# EAGLE schematic Solar LEDs (EAGLE 9.6.2)
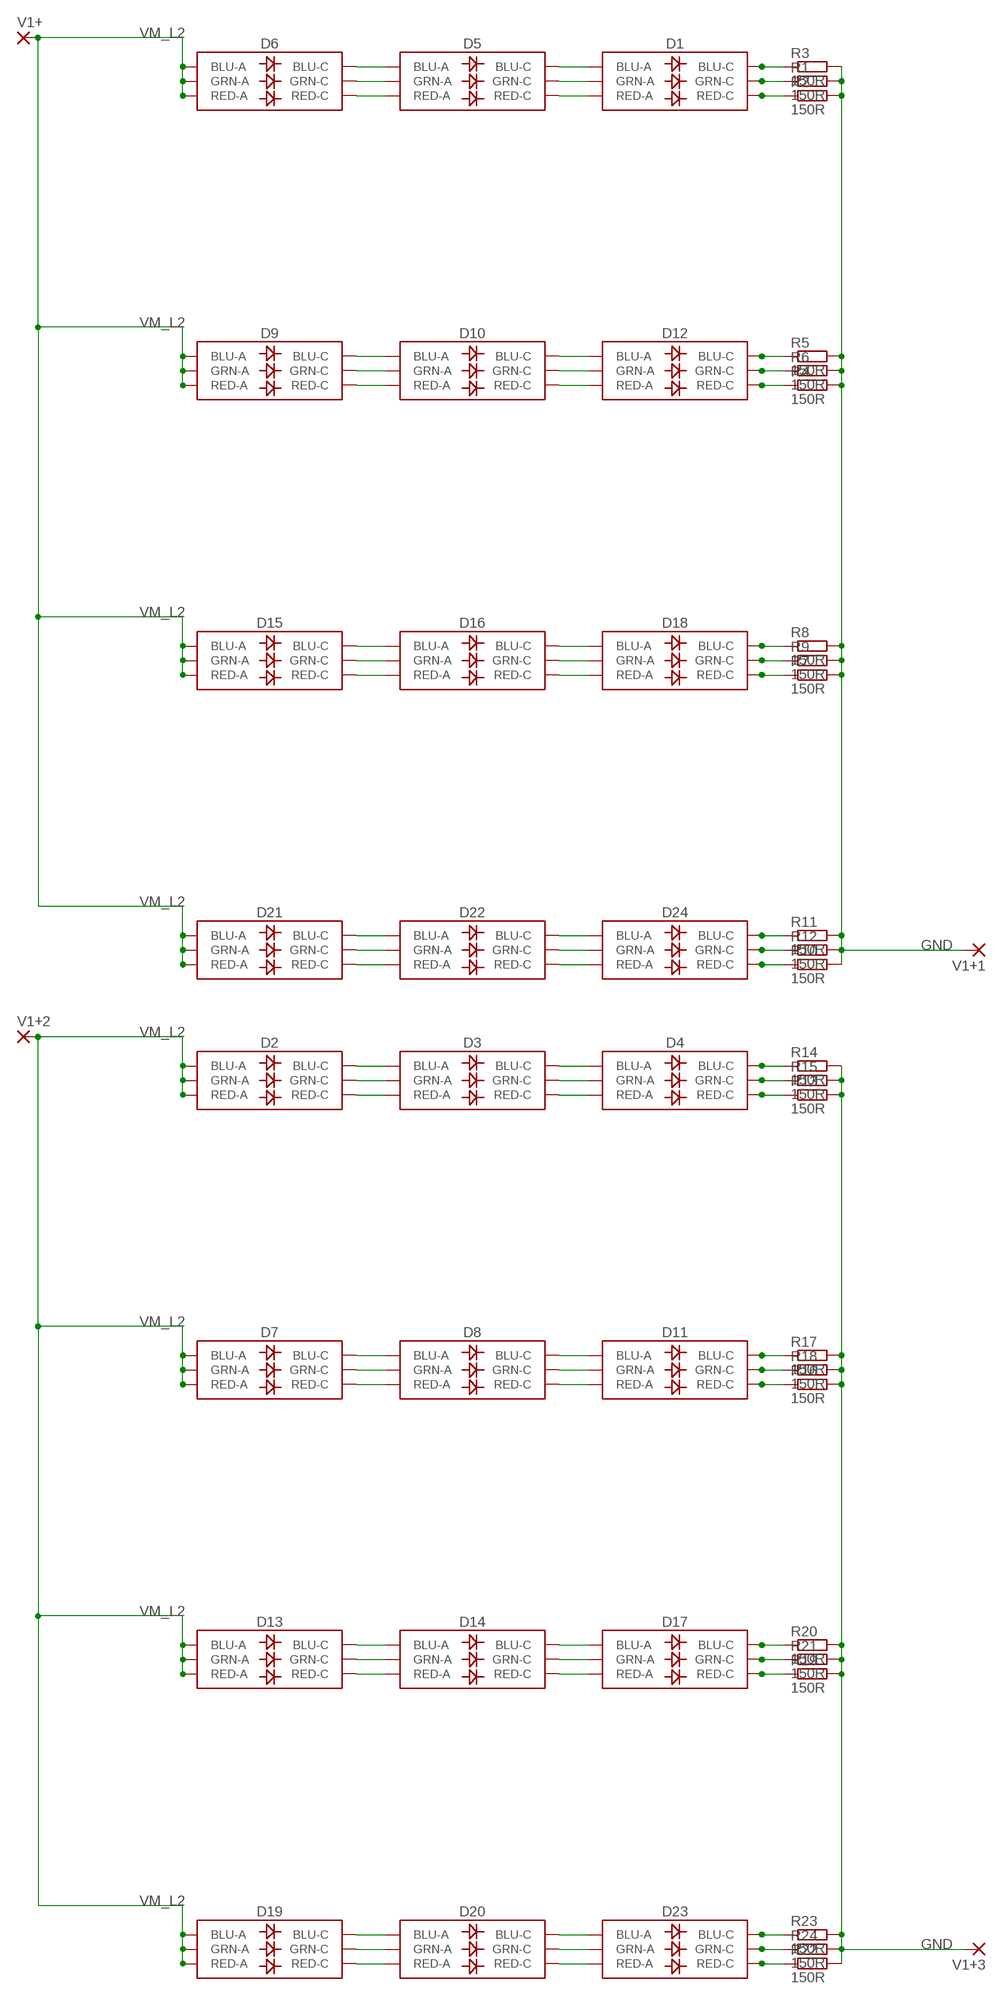
[diagram p0: schematic, sheet 1]

## Parts
D1  LED-RGBNO_IC  [LED-TRICOLOR-5050]
D2  LED-RGBNO_IC  [LED-TRICOLOR-5050]
D3  LED-RGBNO_IC  [LED-TRICOLOR-5050]
D4  LED-RGBNO_IC  [LED-TRICOLOR-5050]
D5  LED-RGBNO_IC  [LED-TRICOLOR-5050]
D6  LED-RGBNO_IC  [LED-TRICOLOR-5050]
D7  LED-RGBNO_IC  [LED-TRICOLOR-5050]
D8  LED-RGBNO_IC  [LED-TRICOLOR-5050]
D9  LED-RGBNO_IC  [LED-TRICOLOR-5050]
D10  LED-RGBNO_IC  [LED-TRICOLOR-5050]
D11  LED-RGBNO_IC  [LED-TRICOLOR-5050]
D12  LED-RGBNO_IC  [LED-TRICOLOR-5050]
D13  LED-RGBNO_IC  [LED-TRICOLOR-5050]
D14  LED-RGBNO_IC  [LED-TRICOLOR-5050]
D15  LED-RGBNO_IC  [LED-TRICOLOR-5050]
D16  LED-RGBNO_IC  [LED-TRICOLOR-5050]
D17  LED-RGBNO_IC  [LED-TRICOLOR-5050]
D18  LED-RGBNO_IC  [LED-TRICOLOR-5050]
D19  LED-RGBNO_IC  [LED-TRICOLOR-5050]
D20  LED-RGBNO_IC  [LED-TRICOLOR-5050]
D21  LED-RGBNO_IC  [LED-TRICOLOR-5050]
D22  LED-RGBNO_IC  [LED-TRICOLOR-5050]
D23  LED-RGBNO_IC  [LED-TRICOLOR-5050]
D24  LED-RGBNO_IC  [LED-TRICOLOR-5050]
R1  150R  R-EU_M1206  [M1206]
R2  150R  R-EU_M1206  [M1206]
R3  150R  R-EU_M1206  [M1206]
R4  150R  R-EU_M1206  [M1206]
R5  150R  R-EU_M1206  [M1206]
R6  150R  R-EU_M1206  [M1206]
R7  150R  R-EU_M1206  [M1206]
R8  150R  R-EU_M1206  [M1206]
R9  150R  R-EU_M1206  [M1206]
R10  150R  R-EU_M1206  [M1206]
R11  150R  R-EU_M1206  [M1206]
R12  150R  R-EU_M1206  [M1206]
R13  150R  R-EU_M1206  [M1206]
R14  150R  R-EU_M1206  [M1206]
R15  150R  R-EU_M1206  [M1206]
R16  150R  R-EU_M1206  [M1206]
R17  150R  R-EU_M1206  [M1206]
R18  150R  R-EU_M1206  [M1206]
R19  150R  R-EU_M1206  [M1206]
R20  150R  R-EU_M1206  [M1206]
R21  150R  R-EU_M1206  [M1206]
R22  150R  R-EU_M1206  [M1206]
R23  150R  R-EU_M1206  [M1206]
R24  150R  R-EU_M1206  [M1206]
V1+  2,54/1,0  [2,54/1,0]
V1+1  2,54/1,0  [2,54/1,0]
V1+2  2,54/1,0  [2,54/1,0]
V1+3  2,54/1,0  [2,54/1,0]

## Nets
GND: R1.2 R2.2 R3.2 R4.2 R5.2 R6.2 R7.2 R8.2 R9.2 R10.2 R11.2 R12.2 R13.2 R14.2 R15.2 R16.2 R17.2 R18.2 R19.2 R20.2 R21.2 R22.2 R23.2 R24.2 V1+1.1(P) V1+3.1(P)
N$1: D2.4(BLU-C) D3.3(BLU-A)
N$2: D9.4(BLU-C) D10.3(BLU-A)
N$3: D9.6(GRN-C) D10.1(GRN-A)
N$4: D9.5(RED-C) D10.2(RED-A)
N$5: D2.6(GRN-C) D3.1(GRN-A)
N$6: D2.5(RED-C) D3.2(RED-A)
N$7: D3.4(BLU-C) D4.3(BLU-A)
N$8: D3.6(GRN-C) D4.1(GRN-A)
N$9: D3.5(RED-C) D4.2(RED-A)
N$10: D4.4(BLU-C) R14.1
N$11: D4.6(GRN-C) R15.1
N$12: D4.5(RED-C) R13.1
N$13: D7.4(BLU-C) D8.3(BLU-A)
N$14: D10.4(BLU-C) D12.3(BLU-A)
N$15: D10.6(GRN-C) D12.1(GRN-A)
N$16: D10.5(RED-C) D12.2(RED-A)
N$17: D12.4(BLU-C) R5.1
N$18: D12.6(GRN-C) R6.1
N$19: D5.3(BLU-A) D6.4(BLU-C)
N$20: D5.1(GRN-A) D6.6(GRN-C)
N$21: D5.2(RED-A) D6.5(RED-C)
N$22: D7.6(GRN-C) D8.1(GRN-A)
N$23: D7.5(RED-C) D8.2(RED-A)
N$24: D8.4(BLU-C) D11.3(BLU-A)
N$25: D8.6(GRN-C) D11.1(GRN-A)
N$26: D8.5(RED-C) D11.2(RED-A)
N$27: D11.4(BLU-C) R17.1
N$28: D11.6(GRN-C) R18.1
N$29: D11.5(RED-C) R16.1
N$30: D13.4(BLU-C) D14.3(BLU-A)
N$31: D1.3(BLU-A) D5.4(BLU-C)
N$32: D1.1(GRN-A) D5.6(GRN-C)
N$33: D1.2(RED-A) D5.5(RED-C)
N$34: D12.5(RED-C) R4.1
N$35: D15.4(BLU-C) D16.3(BLU-A)
N$36: D15.6(GRN-C) D16.1(GRN-A)
N$37: D15.5(RED-C) D16.2(RED-A)
N$38: D13.6(GRN-C) D14.1(GRN-A)
N$39: D13.5(RED-C) D14.2(RED-A)
N$40: D14.4(BLU-C) D17.3(BLU-A)
N$41: D14.6(GRN-C) D17.1(GRN-A)
N$42: D14.5(RED-C) D17.2(RED-A)
N$43: D1.4(BLU-C) R3.1
N$44: D1.6(GRN-C) R1.1
N$45: D1.5(RED-C) R2.1
N$46: D17.4(BLU-C) R20.1
N$47: D17.6(GRN-C) R21.1
N$48: D17.5(RED-C) R19.1
N$49: D19.4(BLU-C) D20.3(BLU-A)
N$50: D16.4(BLU-C) D18.3(BLU-A)
N$51: D16.6(GRN-C) D18.1(GRN-A)
N$52: D16.5(RED-C) D18.2(RED-A)
N$53: D18.4(BLU-C) R8.1
N$54: D18.6(GRN-C) R9.1
N$55: D18.5(RED-C) R7.1
N$56: D21.4(BLU-C) D22.3(BLU-A)
N$57: D21.6(GRN-C) D22.1(GRN-A)
N$58: D21.5(RED-C) D22.2(RED-A)
N$59: D19.6(GRN-C) D20.1(GRN-A)
N$60: D19.5(RED-C) D20.2(RED-A)
N$61: D20.4(BLU-C) D23.3(BLU-A)
N$62: D20.6(GRN-C) D23.1(GRN-A)
N$63: D20.5(RED-C) D23.2(RED-A)
N$64: D23.4(BLU-C) R23.1
N$65: D23.6(GRN-C) R24.1
N$66: D23.5(RED-C) R22.1
N$68: D22.4(BLU-C) D24.3(BLU-A)
N$69: D22.6(GRN-C) D24.1(GRN-A)
N$70: D22.5(RED-C) D24.2(RED-A)
N$71: D24.4(BLU-C) R11.1
N$72: D24.6(GRN-C) R12.1
N$73: D24.5(RED-C) R10.1
VM_L2: D2.1(GRN-A) D2.2(RED-A) D2.3(BLU-A) D6.1(GRN-A) D6.2(RED-A) D6.3(BLU-A) D7.1(GRN-A) D7.2(RED-A) D7.3(BLU-A) D9.1(GRN-A) D9.2(RED-A) D9.3(BLU-A) D13.1(GRN-A) D13.2(RED-A) D13.3(BLU-A) D15.1(GRN-A) D15.2(RED-A) D15.3(BLU-A) D19.1(GRN-A) D19.2(RED-A) D19.3(BLU-A) D21.1(GRN-A) D21.2(RED-A) D21.3(BLU-A) V1+2.1(P) V1+.1(P)

## Library data of the parts
D1-D24 = SparkFun-LED:LED-RGB: LED-RGB 6 pin RGB LED (no common connector) Packages: PLCC-6 LED-TRICOLOR-5050 - No built-in IC SparkFun Products: Digital Sandbox <https://www.sparkfun.com/products/12651> LED- SMD RGB <https://www.sparkfun.com/products/10866>; PROD_ID: DIO-10298
R1-R24 = rcl:R-EU_: RESISTOR, European symbol
V1+ V1+1-V1+3 = wirepad:2,54/1,0: THROUGH-HOLE PAD

## Net classes
0 default: width 0.203 mm, clearance 0.152 mm